# EasyEDA Pro project ProPrj_智能视觉集成板-V3.0.epro, schematic Schematic1

## Sheets
1 母版 连接器: Board Name: 母板 V2.1; Create Date: 2025-06-25; Page Name: 母版 连接器; Project Name: 009-智能视觉集成板-V3.0; Schematic Name: Schematic1; Update Date: 2025-06-25; Company: 嘉立创EDA; Page Size: A4; Version: V1.0
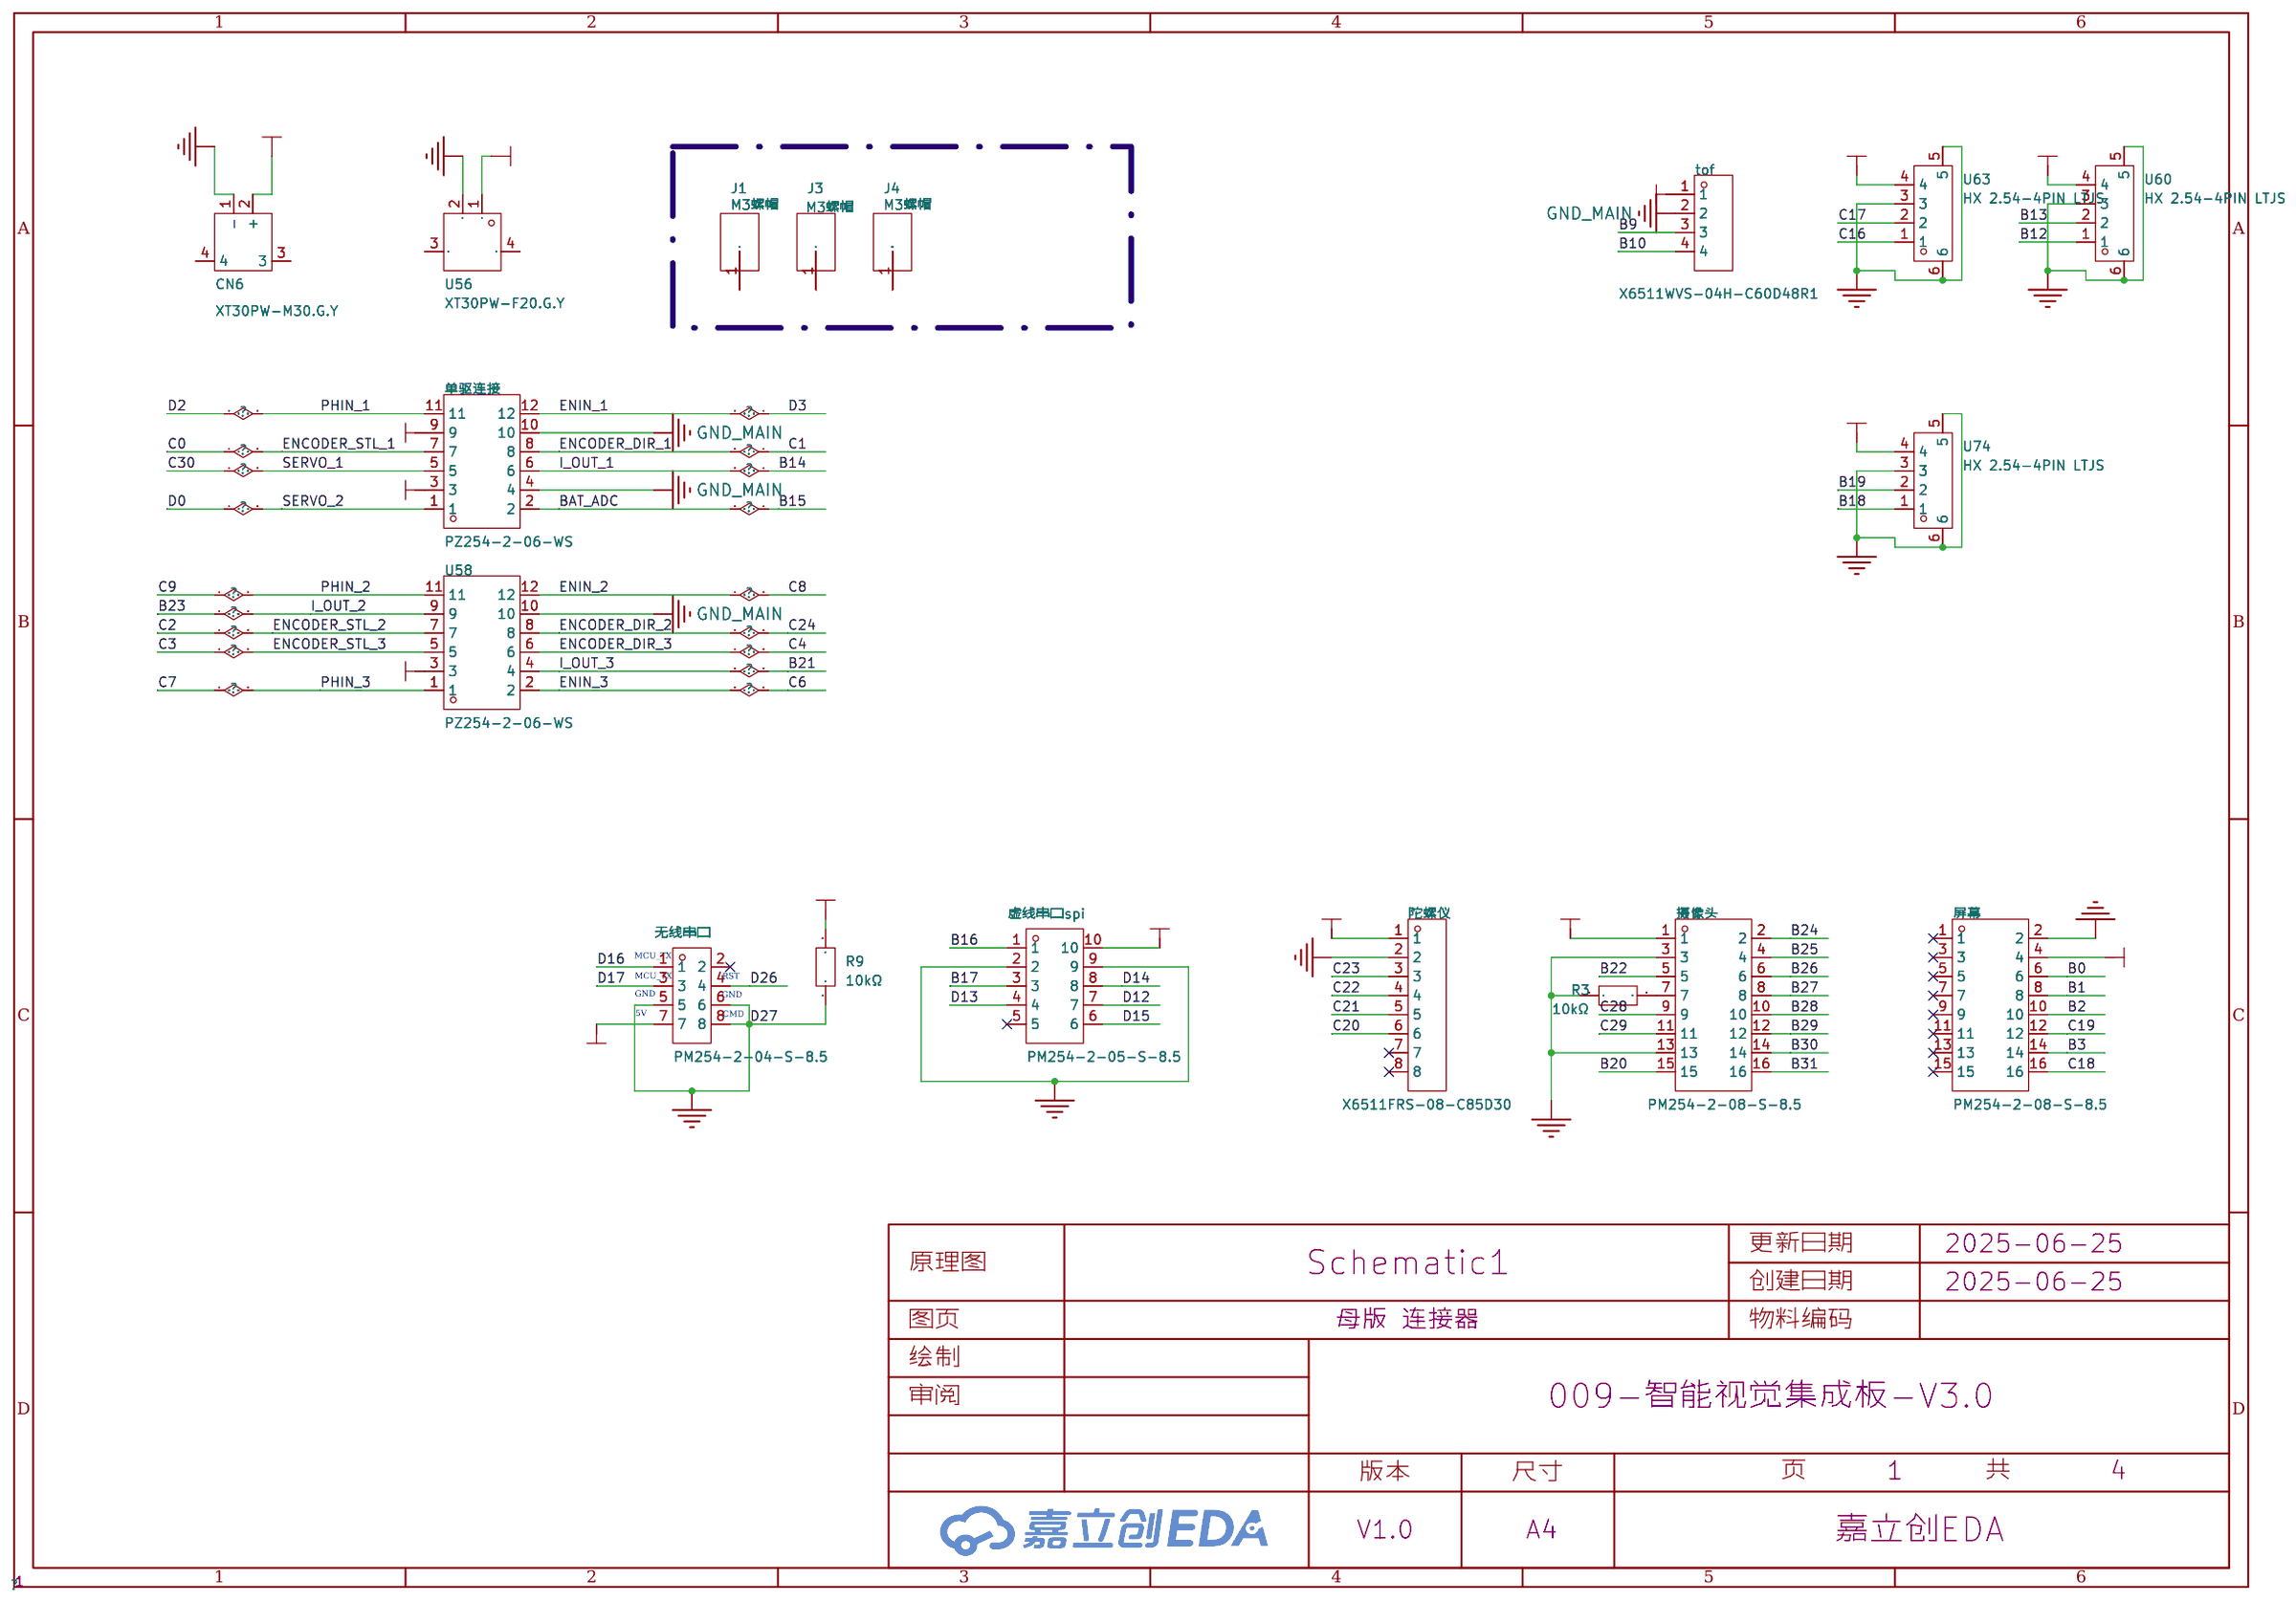
[diagram p0: 母版 连接器]
2 母版 主板: Board Name: 母板; Create Date: 2025-04-21; Page Name: 母版 主板; Project Name: 009-智能视觉集成板-V2.0; Update Date: 2025-04-22
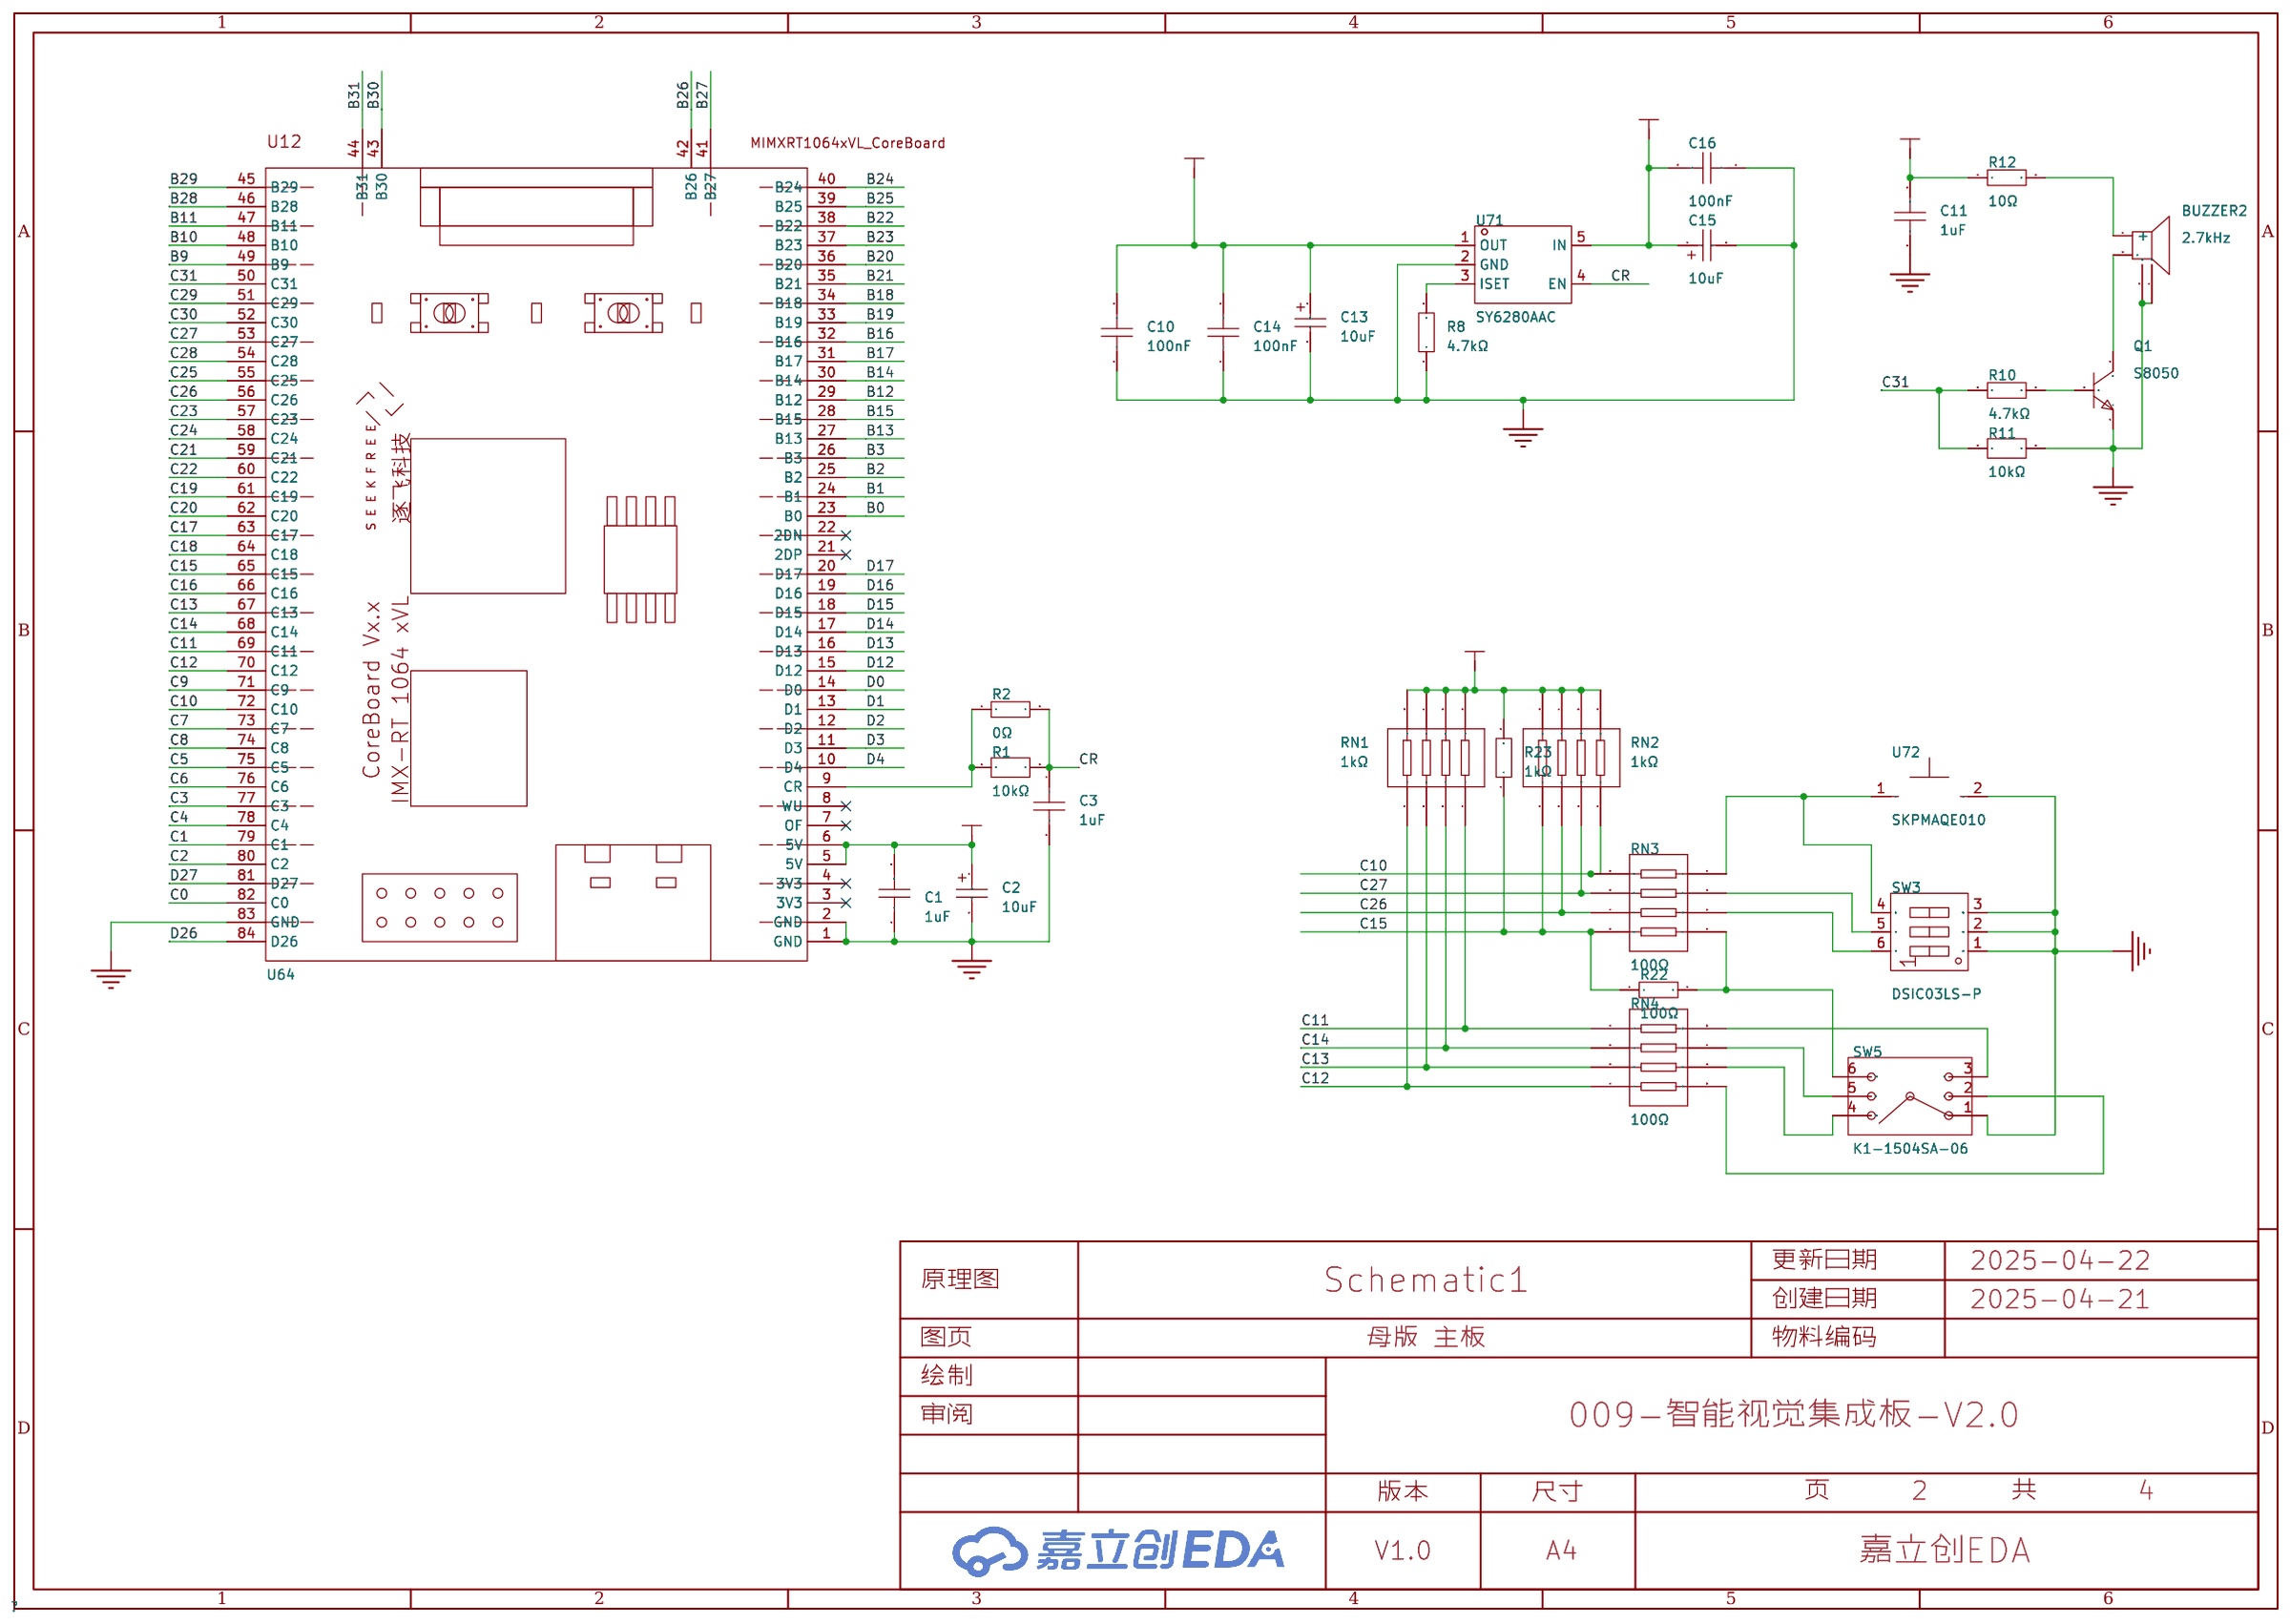
[diagram p1: 母版 主板]
3 母版 电源: Board Name: 母板; Create Date: 2025-01-11; Page Name: 母版 电源; Project Name: 009-智能视觉集成板-V1.1; Update Date: 2025-01-11
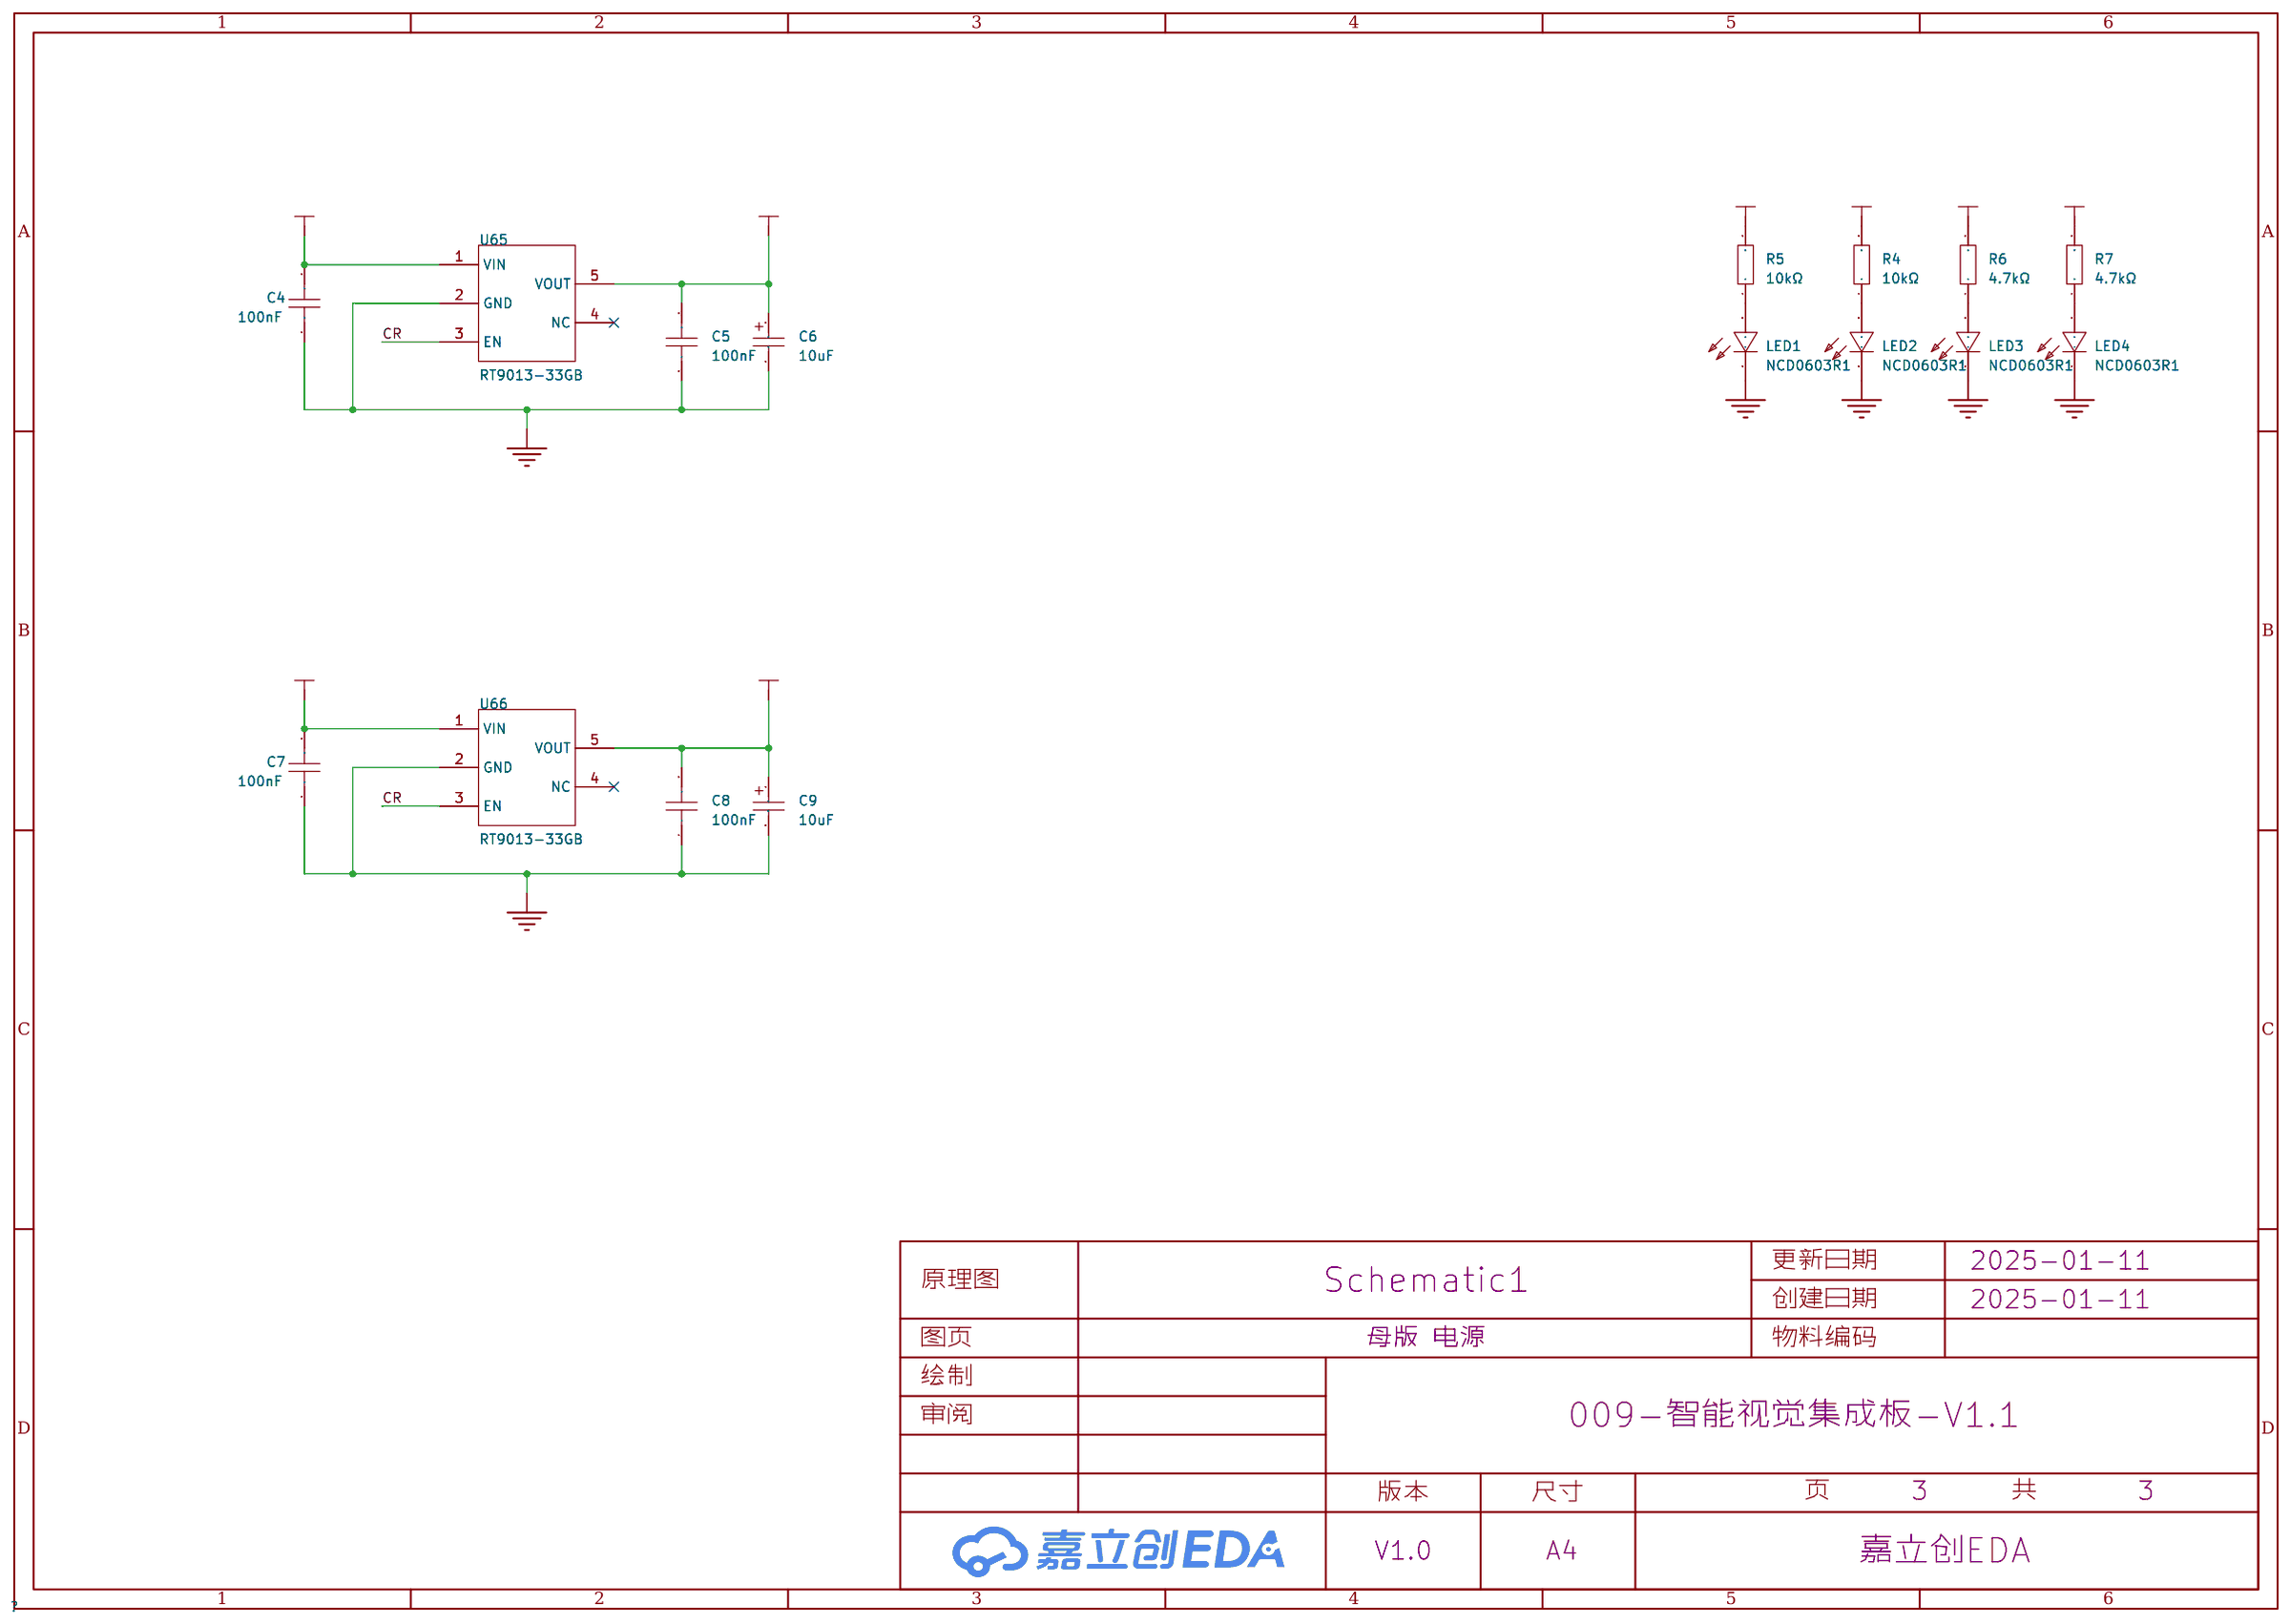
[diagram p2: 母版 电源]
4 母板 灰度传感器运放: Board Name: 母板; Create Date: 2025-04-21; Page Name: P5; Project Name: 009-智能视觉集成板-V2.0; Update Date: 2025-04-21
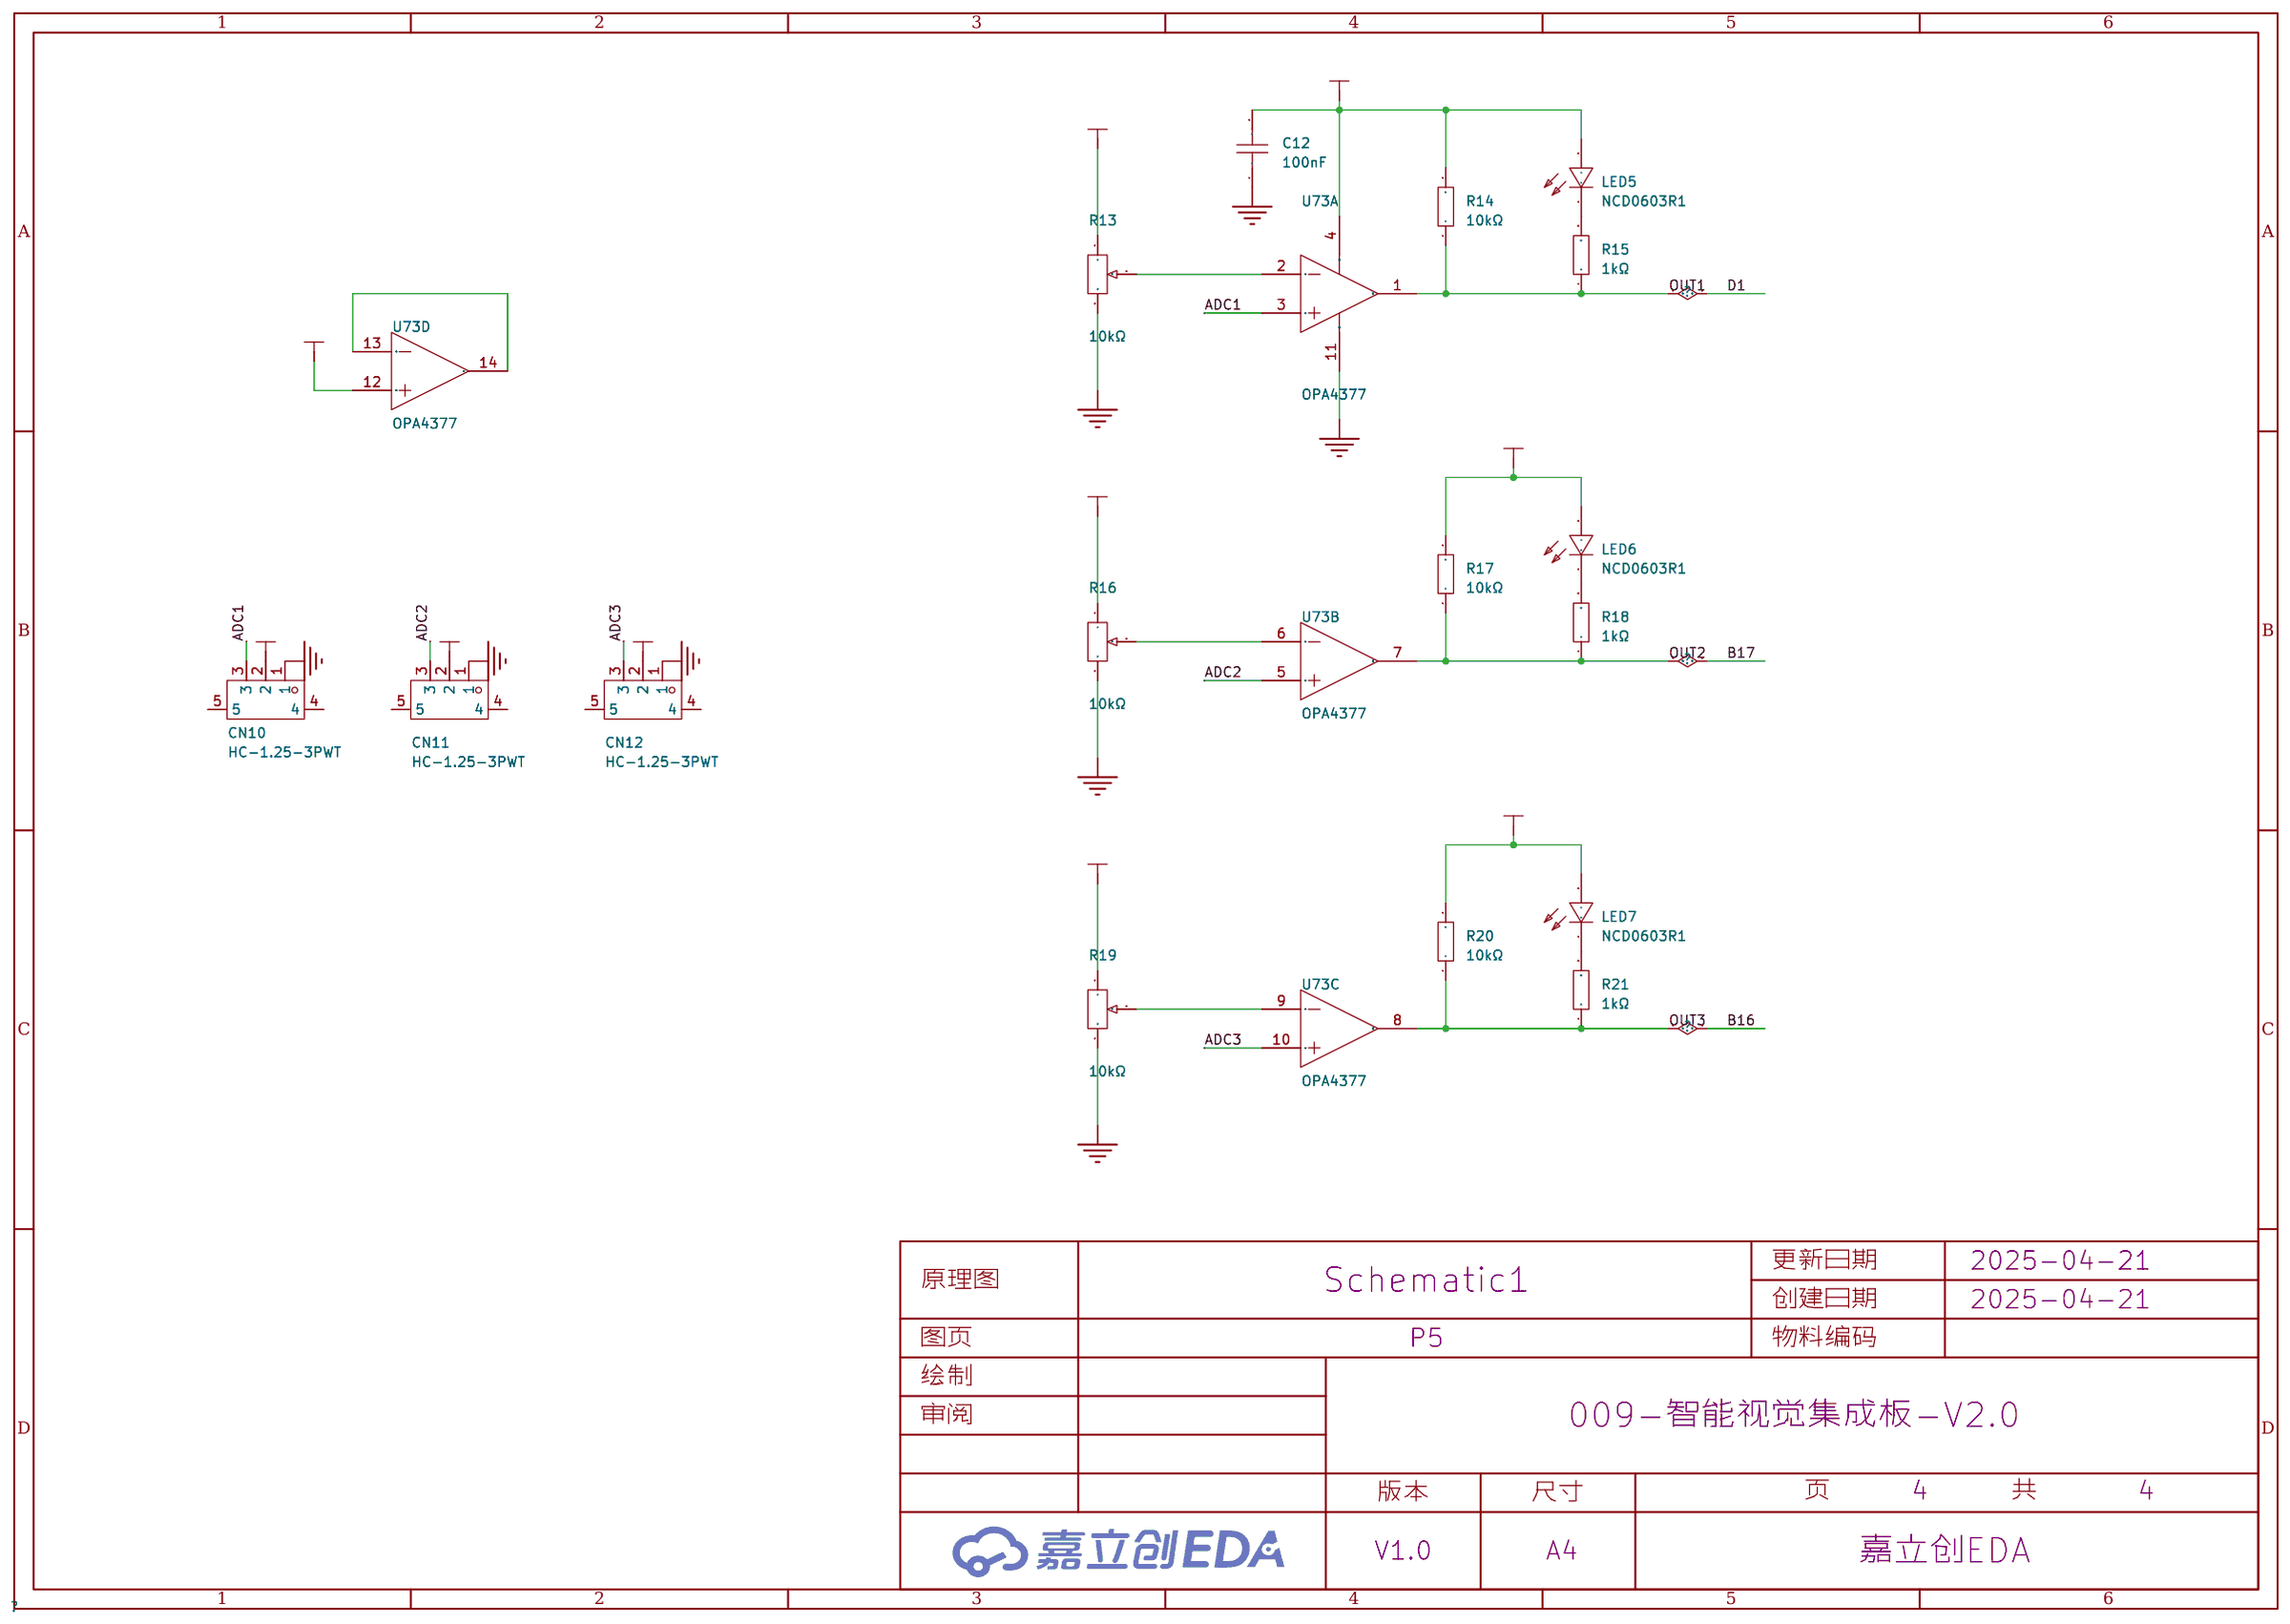
[diagram p3: 母板 灰度传感器运放]

## Parts
sheet 母板 灰度传感器运放
C12  100nF  [C0603]
CN10  HC-1.25-3PWT  [CONN-SMD_HC-1.25-3PWT]
CN11  HC-1.25-3PWT  [CONN-SMD_HC-1.25-3PWT]
CN12  HC-1.25-3PWT  [CONN-SMD_HC-1.25-3PWT]
LED5  NCD0603R1  [LED0603-RD_RED]
LED6  NCD0603R1  [LED0603-RD_RED]
LED7  NCD0603R1  [LED0603-RD_RED]
R13  10kΩ  [RES-ADJ-TH_3P-L5.0-W4.5-P2.35-BR]
R14  10kΩ  [R0603]
R15  1kΩ  [R0603]
R16  10kΩ  [RES-ADJ-TH_3P-L5.0-W4.5-P2.35-BR]
R17  10kΩ  [R0603]
R18  1kΩ  [R0603]
R19  10kΩ  [RES-ADJ-TH_3P-L5.0-W4.5-P2.35-BR]
R20  10kΩ  [R0603]
R21  1kΩ  [R0603]
U73  OPA4377  [TSSOP-14_L5.0-W4.4-P0.65-LS6.4-BL]  (sections 1,2,3,4)
sheet 母版 主板
BUZZER2  2.7kHz  [BUZ-SMD_4P-L8.5-W8.5-P8.50-BR]
C1  1uF  [C0603]
C2  10uF  [CAP-SMD_L3.2-W1.6-RD-C7171]
C3  1uF  [C0603]
C10  100nF  [C0603]
C11  1uF  [C0603]
C13  10uF  [CAP-SMD_L3.2-W1.6-RD-C7171]
C14  100nF  [C0603]
C15  10uF  [CAP-SMD_L3.2-W1.6-RD-C7171]
C16  100nF  [C0603]
Q1  S8050  [SOT-23-3_L2.9-W1.3-P1.90-LS2.3-BR]
R1  10kΩ  [R0603]
R2  0Ω  [R0603]
R8  4.7kΩ  [R0603]
R10  4.7kΩ  [R0603]
R11  10kΩ  [R0603]
R12  10Ω  [R0603]
R22  100Ω  [R0603]
R23  1kΩ  [R0603]
RN1  1kΩ  [RES-ARRAY-SMD_0603-8P-L3.2-W1.6-BL]
RN2  1kΩ  [RES-ARRAY-SMD_0603-8P-L3.2-W1.6-BL]
RN3  100Ω  [RES-ARRAY-SMD_0603-8P-L3.2-W1.6-BL]
RN4  100Ω  [RES-ARRAY-SMD_0603-8P-L3.2-W1.6-BL]
SW3  DSIC03LS-P  [SW-SMD_6P-L8.6-W6.2-P2.54-LS9.8]
SW5  K1-1504SA-06  [SW-SMD_K1-1504SA-06]
U64  -  [MIMXRT1064xVL_CoreBoard - 3D]
U71  SY6280AAC  [SOT-23-5_L3.0-W1.7-P0.95-LS2.8-BL]
U72  SKPMAQE010  [KEY-SMD_2P-L6.0-W6.0-P6.00]
sheet 母版 电源
C4  100nF  [C0603]
C5  100nF  [C0603]
C6  10uF  [CAP-SMD_L3.2-W1.6-RD-C7171]
C7  100nF  [C0603]
C8  100nF  [C0603]
C9  10uF  [CAP-SMD_L3.2-W1.6-RD-C7171]
LED1  NCD0603R1  [LED0603-RD_RED]
LED2  NCD0603R1  [LED0603-RD_RED]
LED3  NCD0603R1  [LED0603-RD_RED]
LED4  NCD0603R1  [LED0603-RD_RED]
R4  10kΩ  [R0603]
R5  10kΩ  [R0603]
R6  4.7kΩ  [R0603]
R7  4.7kΩ  [R0603]
U65  RT9013-33GB  [SOT-23-5_L3.0-W1.7-P0.95-LS2.8-BL]
U66  RT9013-33GB  [SOT-23-5_L3.0-W1.7-P0.95-LS2.8-BL]
sheet 母版 连接器
CN6  XT30PW-M30.G.Y  [CONN-TH_XT30PW-M]
J1  M3螺帽  [M3螺帽]
J3  M3螺帽  [M3螺帽]
J4  M3螺帽  [M3螺帽]
R3  10kΩ  [R0603]
R9  10kΩ  [R0603]
tof  X6511WVS-04H-C60D48R1  [HDR-SMD_4P-P2.54-V-M-S4.8]
U56  XT30PW-F20.G.Y  [CONN-TH_XT30PW-F-1]
U58  PZ254-2-06-WS  [HDR-SMD_12P-P2.54_HCTL_PZ254-2-06-WS]
U60  HX 2.54-4PIN LTJS  [CONN-SMD_4P-P2.54_HX-2.54-4PIN-LTJS]
U63  HX 2.54-4PIN LTJS  [CONN-SMD_4P-P2.54_HX-2.54-4PIN-LTJS]
U74  HX 2.54-4PIN LTJS  [CONN-SMD_4P-P2.54_HX-2.54-4PIN-LTJS]
单驱连接  PZ254-2-06-WS  [HDR-SMD_12P-P2.54_HCTL_PZ254-2-06-WS]
屏幕  PM254-2-08-S-8.5  [HDR-SMD_16P-P2.54-V-F-R2-C8-LS7.1]
摄像头  PM254-2-08-S-8.5  [HDR-SMD_16P-P2.54-V-F-R2-C8-LS7.1]
无线串口  PM254-2-04-S-8.5  [HDR-SMD_8P-P2.54-V-F-R2-C4-S7.1]
虚线串口spi  PM254-2-05-S-8.5  [HDR-SMD_10P-P2.54-V-F-R2-C5-LS7.1-1]
陀螺仪  X6511FRS-08-C85D30  [HDR-SMD_8P-P2.54-H-F-L11.5]

## Library data of the parts
C4 C5 C7 C8 C10 C12 C14 C16 = CGA0603X7R104K500JT: 容值:100nF;精度:±10%;额定电压:50V;材质(温度系数):X7R;; LCSC Part Name: 100nF ±10% 50V; Supplier Part: C6119867; Manufacturer: HRE(芯声); Supplier Footprint: 0603; JLCPCB Part Class: 扩展库; Supplier: LCSC; Tolerance: ±10%; Voltage Rated: 50V; Temperature Coefficient: X7R
CN10-CN12 = HC-1.25-3PWT: 插针结构:1x3P;间距:1.25mm;安装方式:卧贴;参考系列:PicoBlade(MX 1.25);总PIN数:3P;排数:1;每排PIN数:3;行距:-;额定电流:1A;触头材质:黄铜;触头镀层:锡;工作温度范围:-40℃~+105℃;; LCSC Part Name: 1x3P 间距:1.25mm 卧贴 系列:PicoBlade(MX 1.25); Supplier Part: C2845380; Manufacturer: HCTL(华灿天禄); Supplier Footprint: SMD,P=1.25mm,卧贴; JLCPCB Part Class: 扩展库; Datasheet: https://atta.szlcsc.com/upload/public/pdf/source/20240930/9508A8292CCC87B0C29E3A028D56E30A.pdf; Supplier: LCSC; Pins Structure: 1x3P; Pitch: 1.25mm; Mounting Style: 卧贴; Reference Series: PicoBlade(MX 1.25); Number of Pins: 3P; Number of Rows: 1; Number of PINs Per Row: 3; Current Rating (Max): 1A; Contact Material: 黄铜; Contact Plating: 锡; Operating Temperature Range: -40℃~+105℃; Rated Voltage (Max): 125V; Plastic Material: LCP; Flame Retardant Rating: UL94V-0; Supplementary Features: 辅助焊脚; Z-Height of the Board: 3.57mm; X-Length of Bottom Edge on Board (Spacing Line): 8.8mm; Y-Width of Bottom Edge on Board: 5.25mm
LED1-LED7 = NCD0603R1_C84263: 灯头类型:-;发光颜色:红色;正向电压(VF):1.6V~2.6V;功率:65mW;正向电流:20mA;主波长:615nm~630nm;二极管配置:独立二极管;透镜颜色:无色透明透镜;色温:-;发光强度:80mcd~220mcd;发光角度:130°;载带方式:-;工作温度:-30℃~+85℃;; Supplier Part: C84263; Manufacturer: 国星光电; Supplier Footprint: 0603; JLCPCB Part Class: 扩展库; Datasheet: https://atta.szlcsc.com/upload/public/pdf/source/20200820/C84263_DABC6A75E58F576973B407FDBA283D60.pdf; Supplier: LCSC; Emitted Color: 红色; Forward Voltage (VF): 1.6V~2.6V; Power Dissipation: 65mW; Forward Current: 20mA; Dominant Wavelength: 615nm~630nm; Diode Configuration: 独立二极管; Lens Color: 无色透明透镜; Luminous Intensity: 80mcd~220mcd; Viewing Angle: 130°; Operating Temperature: -30℃~+85℃
R13 R16 R19 = ST-4EA 10K ohm (103): 阻值:10kΩ;精度:±20%;; LCSC Part Name: 10kΩ ±20%; Supplier Part: C132879; Manufacturer: NIDEC(尼得科); Supplier Footprint: SMD; JLCPCB Part Class: 扩展库; Datasheet: https://atta.szlcsc.com/upload/public/pdf/source/20170930/C132883_1506736317962997236.pdf; Supplier: LCSC; Tolerance: ±20%
R4 R5 R14 R15 R17 R18 R20 R21 = 0603WAF1002T5E: 电阻类型:厚膜电阻;阻值:10kΩ;精度:±1%;功率:100mW;最大工作电压:75V;温度系数:±100ppm/℃;; LCSC Part Name: 厚膜电阻 10kΩ ±1% 100mW; Supplier Part: C25804; Manufacturer: UNI-ROYAL(厚声); Supplier Footprint: 0603; JLCPCB Part Class: 基础库; Datasheet: https://atta.szlcsc.com/upload/public/pdf/source/20200306/C422600_1E6D84923E4A46A82E41ADD87F860B5C.pdf; Supplier: LCSC; Type: 厚膜电阻; Tolerance: ±1%; Power(Watts): 100mW; Overload Voltage (Max): 75V; Temperature Coefficient: ±100ppm/℃; Operating Temperature Range: -55℃~+155℃
U73 = OPA4377: 增益带宽积(GBP):5.5MHz;压摆率(SR):2V/us;; LCSC Part Name: OPA4377(TOKMAS); Supplier Part: C7470936; Manufacturer: Tokmas(托克马斯); Supplier Footprint: TSSOP-14; JLCPCB Part Class: 扩展库; Datasheet: https://atta.szlcsc.com/upload/public/pdf/source/20230802/9E83D4BA48932C3E6B90404DEE148918.pdf; Supplier: LCSC; Gain Bandwidth Product(GBP): 5.5MHz; Slew Rate(SR): 2V/us
BUZZER2 = MLT-8530_C94599: 驱动方式:无源(外部驱动);构造类型:电磁式;频率:2.7kHz;声压(SPL):80dB;; LCSC Part Name: MLT-8530; Supplier Part: C94599; Manufacturer: 华能; Manufacturer Part: MLT-8530; Supplier Footprint: SMD,8.5x8.5mm; JLCPCB Part Class: 扩展库; Datasheet: https://atta.szlcsc.com/upload/public/pdf/source/20170522/1495448322339.pdf; Supplier: LCSC; Driver Circuitry: 无源(外部驱动); Technology: 电磁式; Voltage - Supply: 2.5V~4.5V; Sound Pressure Level(SPL): 80dB; Length: 8.5mm; Width: 8.5mm; Height: 3.3mm
C1 C3 C11 = CGA0603X5R105K160JT: 容值:1uF;精度:±10%;额定电压:16V;材质(温度系数):X5R;; LCSC Part Name: 1uF ±10% 16V; Supplier Part: C6119849; Manufacturer: HRE(芯声); Supplier Footprint: 0603; JLCPCB Part Class: 扩展库; Supplier: LCSC; Tolerance: ±10%; Voltage Rated: 16V; Temperature Coefficient: X5R
C2 C6 C9 C13 C15 = TAJA106K016RNJ: 容值:10uF;精度:±10%;额定电压:16V;等效串联电阻:3Ω@100kHz;; LCSC Part Name: 10uF ±10% 16V; Supplier Part: C7171; Manufacturer: Kyocera AVX; Supplier Footprint: CASE-A-3216; JLCPCB Part Class: 基础库; Datasheet: https://atta.szlcsc.com/upload/public/pdf/source/20160107/1457707750344.pdf; Supplier: LCSC; Tolerance: ±10%; Rated Voltage: 16V; Equivalent Series Resistance(ESR): 3Ω@100kHz; Operating Temperature: -55℃~+125℃
Q1 = S8050_C20069125: 晶体管类型:NPN;集电极电流(Ic):500mA;集射极击穿电压(Vceo):25V;功率(Pd):300mW;直流电流增益(hFE@Ic,Vce):120@50mA,1.0V;; LCSC Part Name: hFE:200-350，丝印:J3Y; Supplier Part: C20069125; Manufacturer: 宏迦橙; Supplier Footprint: SOT-23; JLCPCB Part Class: 扩展库; Datasheet: https://atta.szlcsc.com/upload/public/pdf/source/20240403/2D78449C96B6E27F13BF8BDF79E27159.pdf; Supplier: LCSC; Transistor Type: NPN; Collector Current (Ic): 500mA; Collector-Emitter Breakdown Voltage (Vceo): 25V; Power Dissipation (Pd): 300mW; DC Current Gain (hFE@Ic,Vce): 120@50mA,1.0V; Transition Frequency (fT): 100MHz; Collector Cut-Off Current (Icbo): 100nA; Collector-Emitter Saturation Voltage (VCE(sat)@Ic,Ib): 600mV@500mA,50mA; Operating Temperature: -55℃~+150℃
R1 R3 R9 R11 = FRC0603J103TS: 电阻类型:厚膜电阻;阻值:10kΩ;精度:±5%;功率:100mW;最大工作电压:75V;温度系数:±100ppm/℃;; LCSC Part Name: 10kΩ ±5% 100mW 厚膜电阻; Supplier Part: C2930027; Manufacturer: FOJAN(富捷); Supplier Footprint: 0603; JLCPCB Part Class: 扩展库; Datasheet: https://atta.szlcsc.com/upload/public/pdf/source/20211221/925EC7D7225764EE0046F22065062C87.pdf; Supplier: LCSC; Type: 厚膜电阻; Tolerance: ±5%; Power(Watts): 100mW; Overload Voltage (Max): 75V; Temperature Coefficient: ±100ppm/℃; Operating Temperature Range: -55℃~+155℃
R2 = 0603WAF0000T5E: 电阻类型:厚膜电阻;阻值:0Ω;精度:±1%;功率:100mW;最大工作电压:75V;; LCSC Part Name: 0Ω ±1% 100mW 厚膜电阻; Supplier Part: C21189; Manufacturer: UNI-ROYAL(厚声); Supplier Footprint: 0603; JLCPCB Part Class: 基础库; Datasheet: https://atta.szlcsc.com/upload/public/pdf/source/20200306/C422600_1E6D84923E4A46A82E41ADD87F860B5C.pdf; Supplier: LCSC; Type: 厚膜电阻; Tolerance: ±1%; Power(Watts): 100mW; Overload Voltage (Max): 75V; Operating Temperature Range: -55℃~+155℃
R6-R8 R10 = 0603WAF4701T5E: 电阻类型:厚膜电阻;阻值:4.7kΩ;精度:±1%;功率:100mW;最大工作电压:75V;温度系数:±100ppm/℃;; LCSC Part Name: 4.7kΩ ±1% 100mW 厚膜电阻; Supplier Part: C23162; Manufacturer: UNI-ROYAL(厚声); Supplier Footprint: 0603; JLCPCB Part Class: 基础库; Datasheet: https://atta.szlcsc.com/upload/public/pdf/source/20200306/C422600_1E6D84923E4A46A82E41ADD87F860B5C.pdf; Supplier: LCSC; Type: 厚膜电阻; Tolerance: ±1%; Power(Watts): 100mW; Overload Voltage (Max): 75V; Temperature Coefficient: ±100ppm/℃; Operating Temperature Range: -55℃~+155℃
R12 = 0603WAF100JT5E: 电阻类型:厚膜电阻;阻值:10Ω;精度:±1%;功率:100mW;最大工作电压:75V;温度系数:±400ppm/℃;; LCSC Part Name: 10Ω ±1% 100mW 厚膜电阻; Supplier Part: C22859; Manufacturer: UNI-ROYAL(厚声); Supplier Footprint: 0603; JLCPCB Part Class: 基础库; Datasheet: https://atta.szlcsc.com/upload/public/pdf/source/20200306/C422600_1E6D84923E4A46A82E41ADD87F860B5C.pdf; Supplier: LCSC; Type: 厚膜电阻; Tolerance: ±1%; Power(Watts): 100mW; Overload Voltage (Max): 75V; Temperature Coefficient: ±400ppm/℃; Operating Temperature Range: -55℃~+155℃
R22 = 0603WAF1000T5E: 电阻类型:厚膜电阻;阻值:100Ω;精度:±1%;功率:100mW;最大工作电压:75V;温度系数:±200ppm/℃;; LCSC Part Name: 100Ω ±1% 100mW 厚膜电阻; Supplier Part: C22775; Manufacturer: UNI-ROYAL(厚声); Supplier Footprint: 0603; JLCPCB Part Class: 基础库; Datasheet: https://atta.szlcsc.com/upload/public/pdf/source/20200306/C422600_1E6D84923E4A46A82E41ADD87F860B5C.pdf; Supplier: LCSC; Type: 厚膜电阻; Tolerance: ±1%; Power(Watts): 100mW; Overload Voltage (Max): 75V; Temperature Coefficient: ±200ppm/℃; Operating Temperature Range: -55℃~+155℃
R23 = 0603WAF1001T5E: 电阻类型:厚膜电阻;阻值:1kΩ;精度:±1%;功率:100mW;最大工作电压:75V;温度系数:±100ppm/℃;; LCSC Part Name: 1kΩ ±1% 100mW 厚膜电阻; Supplier Part: C21190; Manufacturer: UNI-ROYAL(厚声); Supplier Footprint: 0603; JLCPCB Part Class: 基础库; Datasheet: https://atta.szlcsc.com/upload/public/pdf/source/20200306/C422600_1E6D84923E4A46A82E41ADD87F860B5C.pdf; Supplier: LCSC; Type: 厚膜电阻; Tolerance: ±1%; Power(Watts): 100mW; Overload Voltage (Max): 75V; Temperature Coefficient: ±100ppm/℃; Operating Temperature Range: -55℃~+155℃
RN1 RN2 = 4D03WGJ0102T5E: 电阻器数:4;阻值:1kΩ;精度:±5%;单个元件功率:62.5mW;温度系数:±200ppm/℃;; LCSC Part Name: 1kΩ ±5%; Supplier Part: C20197; Manufacturer: UNI-ROYAL(厚声); Supplier Footprint: 0603x4; JLCPCB Part Class: 基础库; Datasheet: https://atta.szlcsc.com/upload/public/pdf/source/20191224/C474318_2527498AE30E813171187CCD28401A71.pdf; Supplier: LCSC; Number of Resistors: 4; Tolerance: ±5%; Power(Watts): 62.5mW; Temperature Coefficient: ±200ppm/℃; Number of Pins: 8
RN3 RN4 = 4D03WGJ0101T5E: 电阻器数:4;阻值:100Ω;精度:±5%;单个元件功率:62.5mW;温度系数:±200ppm/℃;; LCSC Part Name: 100Ω ±5%; Supplier Part: C25506; Manufacturer: UNI-ROYAL(厚声); Supplier Footprint: 0603x4; JLCPCB Part Class: Extended Part; Datasheet: https://atta.szlcsc.com/upload/public/pdf/source/20191224/C474318_2527498AE30E813171187CCD28401A71.pdf; Supplier: LCSC; Number of Resistors: 4; Tolerance: ±5%; Power(Watts): 62.5mW; Temperature Coefficient: ±200ppm/℃; Number of Pins: 8
SW3 = DSIC03LS-P: 类型:平拨,凸起式;电路结构:单刀单掷;开关位数:3位;额定电流:25mA;额定电压:24V;使用寿命:3千次;颜色:黑色;; LCSC Part Name: 间距2.54mm 平拨,凸起式 3位拨码开关; Supplier Part: C319040; Manufacturer: XKB Connectivity(中国星坤); Supplier Footprint: SMD-6P,6x7.6mm; JLCPCB Part Class: 扩展库; Datasheet: https://atta.szlcsc.com/upload/public/pdf/source/20211009/004AD184124B4CBFBB0B4AFFEA8A3CC9.pdf; Supplier: LCSC; Type: 平拨,凸起式; Circuit: 单刀单掷; Number of Positions: 3位; Pin Style: 鸥翼型; Lead Pitch: 2.54mm; Current Rating: 25mA; Voltage Rating: 24V; Operating Temperature: -20℃~+70℃; Operating Life: 3千次; Color: 黑色
SW5 = K1-1504SA-06: Supplier Part: C136712; Manufacturer: 韩国韩荣; Supplier Footprint: SMD,10x10mm; JLCPCB Part Class: 扩展库; Datasheet: https://atta.szlcsc.com/upload/public/pdf/source/20210810/C19E165DEB2C09DE28F28226FC5359B8.pdf; Supplier: LCSC
U64 = 逐飞RT1064核心板
U71 = SY6280AAC_C55136: 低能耗配电开关; Supplier Part: C55136; Manufacturer: silergy(矽力杰); Supplier Footprint: SOT-23-5; JLCPCB Part Class: 扩展库; Datasheet: https://atta.szlcsc.com/upload/public/pdf/source/20161108/1478586372822.pdf; Supplier: LCSC
U72 = SKPMAQE010: 6*6*5mm 立贴 硅胶软开关 无声静音开关 电路结构:单刀单掷 触点电流:50mA 额定电压(DC):16V 安装方式:立贴 动作力:3.5N 操作寿命:5万次 行程:1.3mm 用途:汽车音响,汽车导航,音响设备,手持设备,通讯设备,测量仪器等各种操作; Supplier Part: C19274389; Manufacturer: ALPSALPINE(阿尔卑斯阿尔派); Supplier Footprint: SMD,6.6x6mm; JLCPCB Part Class: 扩展库; Datasheet: https://atta.szlcsc.com/upload/public/pdf/source/20231201/D724ADF6978EA66A095344C51B88B412.pdf; Supplier: LCSC
U65 U66 = RT9013-33GB: 输出类型:固定;最大输入电压:5.5V;输出电压:3.3V;输出电流:500mA;电源纹波抑制比(PSRR):50dB@(10kHz);输出极性:正极;; LCSC Part Name: 输入5.5V 输出3.3V 500mA; Supplier Part: C47773; Manufacturer: RICHTEK(立锜); Supplier Footprint: SOT-23-5; JLCPCB Part Class: 扩展库; Datasheet: https://atta.szlcsc.com/upload/public/pdf/source/20150504/1457707282459.pdf; Supplier: LCSC; Output Type: 固定; Maximum Input Voltage: 5.5V; Output Voltage: 3.3V; Output Current: 500mA; Power Supply Rejection Ratio (PSRR): 50dB@(10kHz); Dropout Voltage: 400mV@(500mA); standby current: 50uA; Feature: 低ESR；防静电保护；热保护(TSD)；过流保护(OCP)；带使能; Operating Temperature: -40℃~+85℃; Output Polarity: 正极; Number of Outputs: 1
CN6 = XT30PW-M30.G.Y: 类别:-;类型1:-;; LCSC Part Name: AMASS(艾迈斯)航模插头 卧式弯脚 XT30PW-M公头; Supplier Part: C431092; Manufacturer: AMASS(艾迈斯); JLCPCB Part Class: 扩展库; Datasheet: https://atta.szlcsc.com/upload/public/pdf/source/20220222/6A9F22F7850E25B33E1BE430ADF8560B.pdf; Supplier: LCSC; Type: 航模插头; RatedVoltage: DC 500V; InterfaceType: 公头; RatedCurrent: 15A; RecommendedWireGauge: 16/18/20AWG; contact resistance: 1.2mΩ; specifications: 2pin
J1 J3 J4 = M3螺帽
tof = X6511WVS-04H-C60D48R1: 插针结构:1x4P;间距:2.54mm;行距:2.54mm;圆针/方针:方针;安装类型:-;排数:单排;总PIN位数:4P;额定电流:3A;额定电压:250V;配合针长度:-;塑高:2.5mm;端接针长度:-;触头材质:黄铜;触头镀层:金;工作温度范围:-40℃~+105℃;焊接温度(最大值):260℃;颜色:黑色;; LCSC Part Name: 1x4P 间距:2.54mm 方针; Supplier Part: C780062; Manufacturer: XKB Connection(中国星坤); Supplier Footprint: SMD,P=2.54mm; JLCPCB Part Class: 扩展库; Datasheet: https://atta.szlcsc.com/upload/public/pdf/source/20220804/E423AB74ABBD410F84642849337C77AB.pdf; Supplier: LCSC; Pin Structure: 1x4P; Pitch: 2.54mm; Row Spacing: 2.54mm; Circluar Pins/Square Pins: 方针; Number of Rows: 单排; Number of Pins: 4P; Current Rating (Max): 3A; Voltage Rating (Max): 250V; Insulation Height: 2.5mm; Contact Material: 黄铜; Contact Plating: 金; Operating Temperature Range: -40℃~+105℃; Soldering Temperature(Max): 260℃; Color: 黑色
U56 = XT30PW-F20.G.Y: 类别:-;类型1:-;; LCSC Part Name: AMASS(艾迈斯)电源连接器 母头 XT30PW-F; Supplier Part: C2913282; Manufacturer: AMASS(艾迈斯); JLCPCB Part Class: 扩展库; Datasheet: https://atta.szlcsc.com/upload/public/pdf/source/20231218/06CFCF98887A9A87638B0856A725C8FD.pdf; Supplier: LCSC; Type: 航模插头; InterfaceType: 母头
U58 单驱连接 = PZ254-2-06-WS: 插针结构:2x6P;间距:2.54mm;行距:2.54mm;圆针/方针:方针;安装类型:卧贴;排数:双排;总PIN位数:12P;额定电流:3A;额定电压:-;配合针长度:6mm;塑高:2.5mm;端接针长度:-;工作温度范围:-40℃~+105℃;焊接温度(最大值):260℃@10S;颜色:黑色;; LCSC Part Name: 2x6P 间距:2.54mm 方针 卧贴 黑色; Supplier Part: C5149356; Manufacturer: HCTL(华灿天禄); Supplier Footprint: SMD,P=2.54mm,卧贴; JLCPCB Part Class: 扩展库; Datasheet: https://atta.szlcsc.com/upload/public/pdf/source/20230609/395CF6299CB3DEE695290492722C7F5B.pdf; Supplier: LCSC; Pin Structure: 2x6P; Pitch: 2.54mm; Row Spacing: 2.54mm; Circluar Pins/Square Pins: 方针; Mounting Type: 卧贴; Number of Rows: 双排; Number of Pins: 12P; Current Rating (Max): 3A; Length of Mating Pin: 6mm; Insulation Height: 2.5mm; Operating Temperature Range: -40℃~+105℃; Soldering Temperature(Max): 260℃@10S; Color: 黑色
U60 U63 U74 = HX 2.54-4PIN LTJS: 插针结构:1x4P;间距:2.5mm;安装方式:立贴;总PIN数:4P;排数:1;每排PIN数:4;额定电流:3A;工作温度范围:-25℃~+85℃;; Supplier Part: C19270026; Manufacturer: hanxia(韩下); Supplier Footprint: SMD,P=2.5mm; JLCPCB Part Class: 扩展库; Datasheet: https://atta.szlcsc.com/upload/public/pdf/source/20231127/C4D3287CC75559A6A8A5937D0950CE7D.pdf; Supplier: LCSC; Pins Structure: 1x4P; Pitch: 2.5mm; Mounting Style: 立贴; Number of Pins: 4P; Number of Rows: 1; Number of PINs Per Row: 4; Current Rating (Max): 3A; Operating Temperature Range: -25℃~+85℃
屏幕 摄像头 = PM254-2-08-S-8.5: 插孔结构:2x8P;间距:2.54mm;行距:2.54mm;圆孔/方孔:方孔;安装类型:立贴;排数:双排;总孔位数:16P;额定电流:3A;插孔方向:顶部;塑高:8.5mm;触头材质:铜合金;工作温度范围:-40℃~+105℃;焊接温度(最大值):260℃@5S;; LCSC Part Name: 2x8P 间距:2.54mm 立贴; Supplier Part: C3975153; Manufacturer: HCTL(华灿天禄); Supplier Footprint: SMD,P=2.54mm; JLCPCB Part Class: 扩展库; Datasheet: https://atta.szlcsc.com/upload/public/pdf/source/20230609/7C6F8D8E301C6BBC8F19D55951C36597.pdf; Supplier: LCSC; Holes Structure: 2x8P; Pitch: 2.54mm; Row Spacing: 2.54mm; Circular Hole / Square Hole: 方孔; Mounting Type: 立贴; Number of Rows: 双排; Number of Holes: 16P; Current Rating (Max): 3A; Holes Direction: 顶部; Insulation Height: 8.5mm; Contact Material: 铜合金; Operating Temperature Range: -40℃~+105℃; Soldering Temperature(Max): 260℃@5S
无线串口 = PM254-2-04-S-8.5: 插孔结构:2x4P;间距:2.54mm;行距:2.54mm;圆孔/方孔:方孔;安装类型:立贴;排数:双排;总孔位数:8P;额定电流:3A;插孔方向:顶部;塑高:8.5mm;触头材质:铜合金;工作温度范围:-40℃~+105℃;焊接温度(最大值):260℃@5S;; LCSC Part Name: 2x4P 间距:2.54mm 立贴; Supplier Part: C3975149; Manufacturer: HCTL(华灿天禄); Supplier Footprint: SMD,P=2.54mm; JLCPCB Part Class: 扩展库; Datasheet: https://atta.szlcsc.com/upload/public/pdf/source/20230609/7C6F8D8E301C6BBC8F19D55951C36597.pdf; Supplier: LCSC; Holes Structure: 2x4P; Pitch: 2.54mm; Row Spacing: 2.54mm; Circular Hole / Square Hole: 方孔; Mounting Type: 立贴; Number of Rows: 双排; Number of Holes: 8P; Current Rating (Max): 3A; Holes Direction: 顶部; Insulation Height: 8.5mm; Contact Material: 铜合金; Operating Temperature Range: -40℃~+105℃; Soldering Temperature(Max): 260℃@5S
虚线串口spi = PM254-2-05-S-8.5: 插孔结构:2x5P;间距:2.54mm;行距:2.54mm;圆孔/方孔:方孔;安装类型:立贴;排数:双排;总孔位数:10P;额定电流:3A;插孔方向:顶部;塑高:8.5mm;触头材质:铜合金;工作温度范围:-40℃~+105℃;焊接温度(最大值):260℃@5S;; LCSC Part Name: 2x5P 间距:2.54mm 立贴; Supplier Part: C3975150; Manufacturer: HCTL(华灿天禄); Supplier Footprint: SMD,P=2.54mm; JLCPCB Part Class: 扩展库; Datasheet: https://atta.szlcsc.com/upload/public/pdf/source/20230609/7C6F8D8E301C6BBC8F19D55951C36597.pdf; Supplier: LCSC; Holes Structure: 2x5P; Pitch: 2.54mm; Row Spacing: 2.54mm; Circular Hole / Square Hole: 方孔; Mounting Type: 立贴; Number of Rows: 双排; Number of Holes: 10P; Current Rating (Max): 3A; Holes Direction: 顶部; Insulation Height: 8.5mm; Contact Material: 铜合金; Operating Temperature Range: -40℃~+105℃; Soldering Temperature(Max): 260℃@5S
陀螺仪 = X6511FRS-08-C85D30: 插孔结构:1x8P;间距:2.54mm;安装类型:卧贴;排数:单排;总孔位数:8P;塑高:8.5mm;; LCSC Part Name: 间距:2.54mm 1x8P 卧贴; Supplier Part: C5142241; Manufacturer: XKB Connectivity(中国星坤); Supplier Footprint: SMD,P=2.54mm,卧贴; JLCPCB Part Class: 扩展库; Datasheet: https://atta.szlcsc.com/upload/public/pdf/source/20220822/AB9A82E80C220285963E5EFA3BFD32FF.pdf; Supplier: LCSC; Holes Structure: 1x8P; Pitch: 2.54mm; Mounting Type: 卧贴; Number of Rows: 单排; Number of Holes: 8P; Insulation Height: 8.5mm

## Nets
GND_MAIN: BUZZER2.3 BUZZER2.4 C1.1 C2.2 C3.2 C4.1 C5.1 C6.2 C7.1 C8.1 C9.2 C10.1 C11.2 C12.1 C13.2 C14.1 C15.2 C16.1 CN6.1(-) CN10.1 CN11.1 CN12.1 LED1.1(K) LED2.1(K) LED3.1(K) LED4.1(K) Q1.2(E) R3.1 R8.1 R11.2 R13.3 R16.3 R19.3 SW3.1(PIN1) SW3.2(PIN2) SW3.3(PIN3) SW5.1(A) tof.2 U56.2 U58.10 U60.3 U60.5 U60.6 U63.3 U63.5 U63.6 U64.1(GND) U64.2(GND) U64.83(GND) U65.2(GND) U66.2(GND) U71.2(GND) U72.2 U73.11(VSS) U74.3 U74.5 U74.6 单驱连接.4 单驱连接.10 屏幕.2 摄像头.3 摄像头.13 无线串口.5 无线串口.6 虚线串口spi.2 虚线串口spi.9 陀螺仪.2
VCC_3V3: C5.2 C6.1 C11.1 C12.2 CN6.2(+) CN10.2 CN11.2 CN12.2 LED5.2(A) LED6.2(A) LED7.2(A) R6.2 R9.2 R12.1 R13.1 R14.2 R16.1 R17.2 R19.1 R20.2 R23.2 RN1.5 RN1.6 RN1.7 RN1.8 RN2.5 RN2.6 RN2.7 RN2.8 tof.1 U58.3 U65.5(VOUT) U73.4(VDD) U73.12(IND+) 单驱连接.3 单驱连接.9 屏幕.4 陀螺仪.1
VCC_5V: C1.2 C2.1 C4.2 C7.2 C15.1 C16.2 R4.2 U56.1 U64.5(5V) U64.6(5V) U65.1(VIN) U66.1(VIN) U71.5(IN)
VCC_5V_EXT: C10.2 C13.1 C14.2 R5.2 U60.4 U63.4 U71.1(OUT) U74.4 无线串口.7 虚线串口spi.10
VCC_CSI_3V3: C8.2 C9.1 R7.2 U66.5(VOUT) 摄像头.1
ADC1: CN10.3 U73.3(INA+)
ADC2: CN11.3 U73.5(INB+)
ADC3: CN12.3 U73.10(INC+)
B0: U64.23(B0) 屏幕.6
B1: U64.24(B1) 屏幕.8
B2: U64.25(B2) 屏幕.10
B3: U64.26(B3) 屏幕.14
B9: tof.3 U64.49(B9)
B10: tof.4 U64.48(B10)
B11: U64.47(B11)
B12: U60.1 U64.29(B12)
B13: U60.2 U64.27(B13)
B14: U64.30(B14) 单驱连接.6
B15: U64.28(B15) 单驱连接.2
B16: R20.1 R21.1 U64.32(B16) U73.8(OUTC) 虚线串口spi.1
B17: R17.1 R18.1 U64.31(B17) U73.7(OUTB) 虚线串口spi.3
B18: U64.34(B18) U74.1
B19: U64.33(B19) U74.2
B20: U64.36(B20) 摄像头.15
B21: U58.4 U64.35(B21)
B22: U64.38(B22) 摄像头.5
B23: U58.9 U64.37(B23)
B24: U64.40(B24) 摄像头.2
B25: U64.39(B25) 摄像头.4
B26: U64.42(B26) 摄像头.6
B27: U64.41(B27) 摄像头.8
B28: U64.46(B28) 摄像头.10
B29: U64.45(B29) 摄像头.12
B30: U64.43(B30) 摄像头.14
B31: U64.44(B31) 摄像头.16
C0: U64.82(C0) 单驱连接.7
C1: U64.79(C1) 单驱连接.8
C2: U58.7 U64.80(C2)
C3: U58.5 U64.77(C3)
C4: U58.6 U64.78(C4)
C5: U64.75(C5)
C6: U58.2 U64.76(C6)
C7: U58.1 U64.73(C7)
C8: U58.12 U64.74(C8)
C9: U58.11 U64.71(C9)
C10: RN2.4 RN3.5 U64.72(C10)
C11: RN1.4 RN4.1 U64.69(C11)
C12: RN1.1 RN4.4 U64.70(C12)
C13: RN1.2 RN4.3 U64.67(C13)
C14: RN1.3 RN4.2 U64.68(C14)
C15: R22.1 R23.1 RN2.1 RN3.8 U64.65(C15)
C16: U63.1 U64.66(C16)
C17: U63.2 U64.63(C17)
C18: U64.64(C18) 屏幕.16
C19: U64.61(C19) 屏幕.12
C20: U64.62(C20) 陀螺仪.6
C21: U64.59(C21) 陀螺仪.5
C22: U64.60(C22) 陀螺仪.4
C23: U64.57(C23) 陀螺仪.3
C24: U58.8 U64.58(C24)
C25: U64.55(C25)
C26: RN2.2 RN3.7 U64.56(C26)
C27: RN2.3 RN3.6 U64.53(C27)
C28: U64.54(C28) 摄像头.9
C29: U64.51(C29) 摄像头.11
C30: U64.52(C30) 单驱连接.5
C31: R10.2 R11.1 U64.50(C31)
CR: C3.1 R1.2 R2.2 U65.3(EN) U66.3(EN) U71.4(EN)
D0: U64.14(D0) 单驱连接.1
D1: R14.1 R15.1 U64.13(D1) U73.1(OUTA)
D2: U64.12(D2) 单驱连接.11
D3: U64.11(D3) 单驱连接.12
D4: U64.10(D4)
D12: U64.15(D12) 虚线串口spi.7
D13: U64.16(D13) 虚线串口spi.4
D14: U64.17(D14) 虚线串口spi.8
D15: U64.18(D15) 虚线串口spi.6
D16: U64.19(D16) 无线串口.1
D17: U64.20(D17) 无线串口.3
D26: U64.84(D26) 无线串口.4
D27: R9.1 U64.81(D27) 无线串口.8
$1N21001: R3.2 摄像头.7
$3N1397: R1.1 R2.1 U64.9(CR)
$3N1900: R8.2 U71.3(ISET)
$3N2786: BUZZER2.1(+) R12.2
$3N2792: BUZZER2.2 Q1.3(C)
$3N2800: Q1.1(B) R10.1
$3N3710: RN4.8 SW5.3(C)
$3N3730: RN4.7 SW5.5(D)
$3N3739: RN4.6 SW5.4(CENTER)
$3N3749: RN4.5 SW5.2(B)
$4N2636: LED1.2(A) R5.1
$4N2685: LED2.2(A) R4.1
$4N2734: LED3.2(A) R6.1
$4N2783: LED4.2(A) R7.1
$5N459: R13.2 U73.2(INA–)
$5N464: LED5.1(K) R15.2
$5N467: U73.13(IND-) U73.14(OUTD)
$5N1031: R16.2 U73.6(INB-)
$5N1036: LED6.1(K) R18.2
$5N1349: R19.2 U73.9(INC-)
$5N1354: LED7.1(K) R21.2
Net-(R22-2): R22.2 RN3.1 SW5.6(COMMON)
Net-(RN3-2): RN3.2 SW3.6(PIN6)
Net-(RN3-3): RN3.3 SW3.5(PIN5)
Net-(RN3-4): RN3.4 SW3.4(PIN4) U72.1

Not connected (* = marked no-connect by the designer): CN6 3 4; CN10 4 5; CN11 4 5; CN12 4 5; J1 1; J3 1; J4 1; U56 3 4; U64 3(3V3)* 4(3V3)* 7(OF)* 8(WU)* 21(2DP)* 22(2DN)*; U65 4(NC)*; U66 4(NC)*; 屏幕 1* 3* 5* 7* 9* 11* 13* 15*; 无线串口 2*; 虚线串口spi 5*; 陀螺仪 7* 8*

## Notes on the sheets
sheet 1
- MCU_TX
- MCU_TX
- RST
- GND
- GND
- 5V
- CMD
